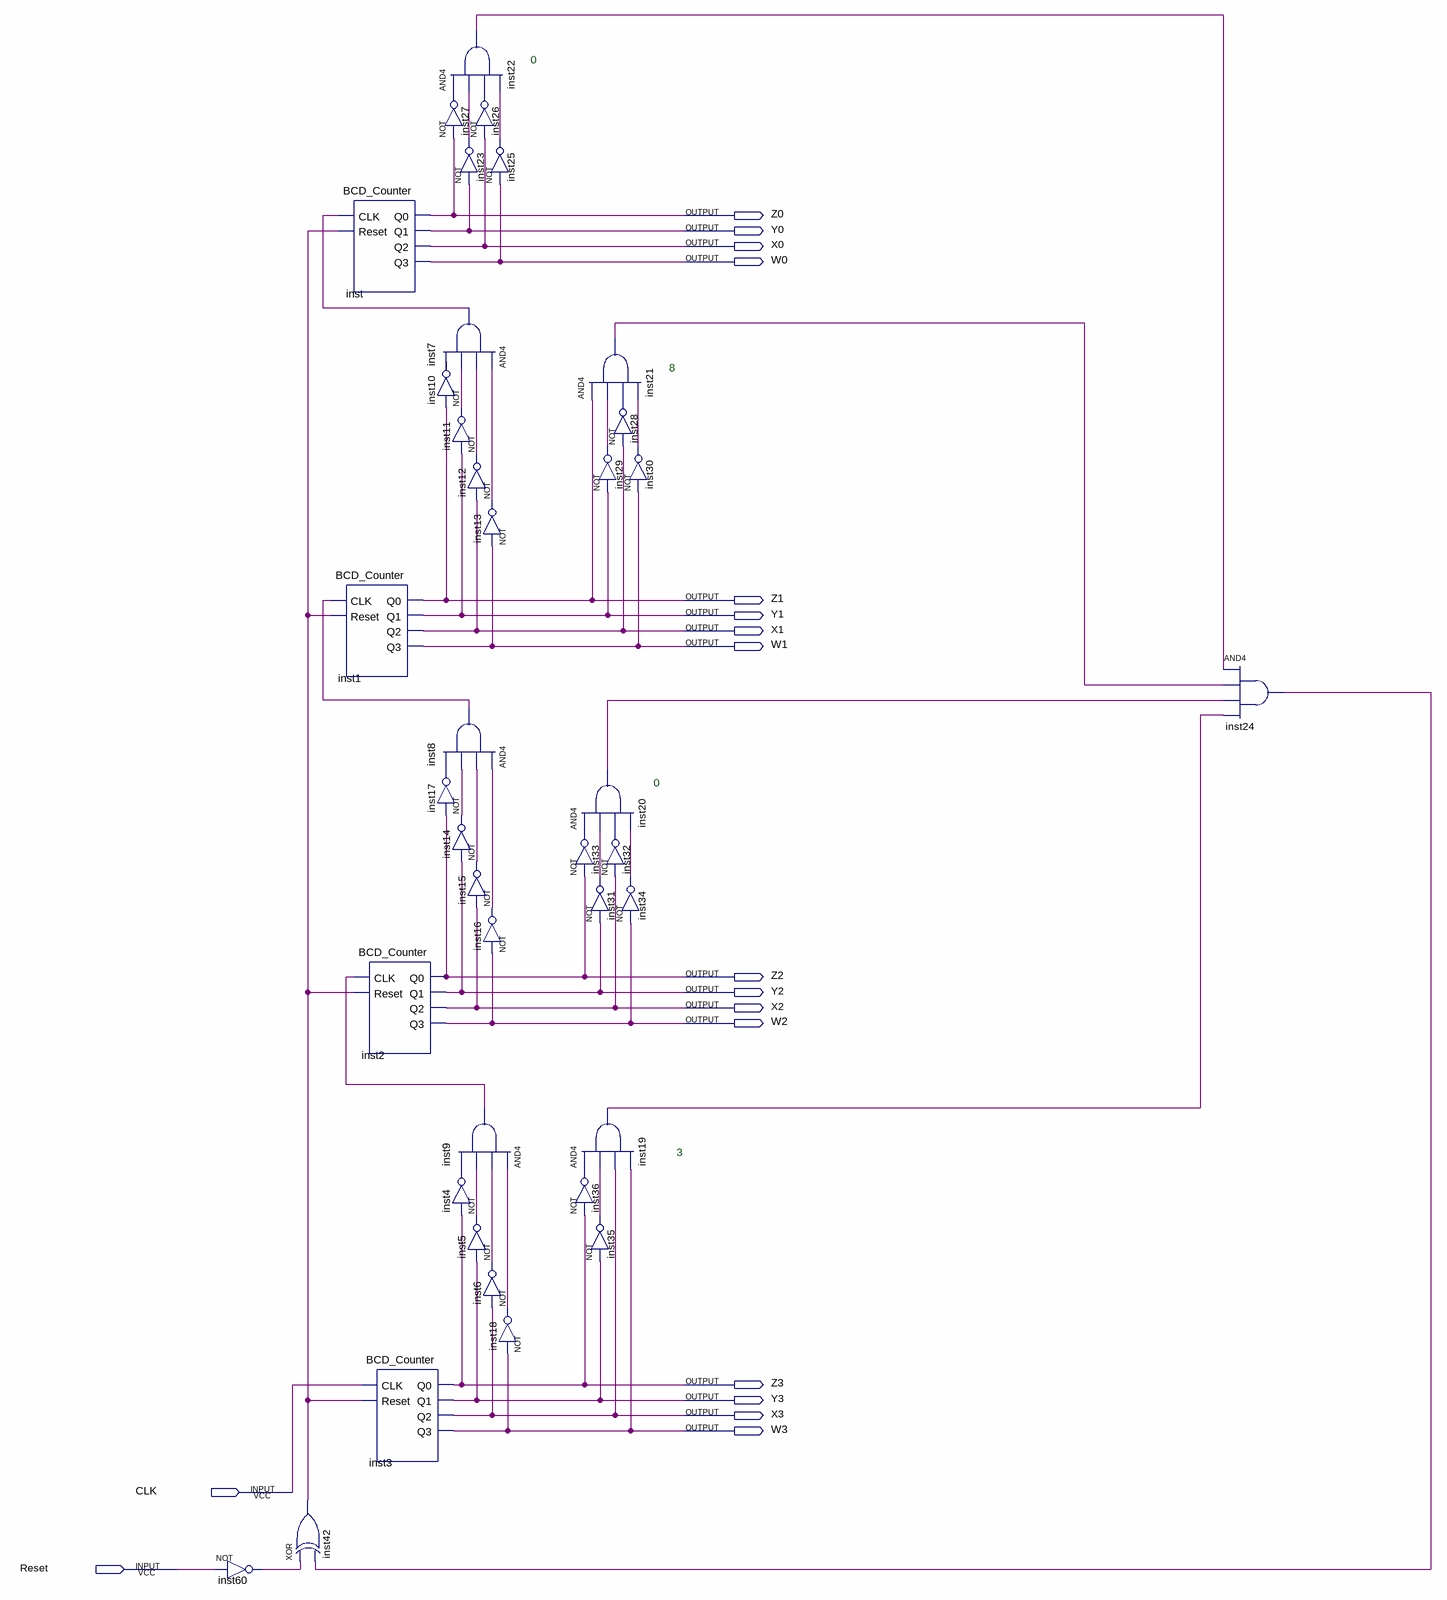
[diagram p0: schematic sheet]
// Quartus schematic Clock_Cycle_Counter.bdf as structural Verilog: 39 symbols, 18 pins
module Clock_Cycle_Counter (
  input  CLK,
  input  Reset,
  output Z0,
  output Y0,
  output X0,
  output W0,
  output Z1,
  output Y1,
  output X1,
  output W1,
  output Z2,
  output Y2,
  output X2,
  output W2,
  output Z3,
  output Y3,
  output X3,
  output W3
);

  wire inst4_out, inst5_out, inst6_out, inst7_out, inst8_out, inst9_out, inst10_out, inst11_out, inst12_out,
       inst13_out, inst14_out, inst15_out, inst16_out, inst17_out, inst18_out, inst19_out, inst20_out,
       inst21_out, inst22_out, inst23_out, inst24_out, inst25_out, inst26_out, inst27_out, inst28_out,
       inst29_out, inst30_out, inst31_out, inst32_out, inst33_out, inst34_out, inst35_out, inst36_out,
       inst42_out, inst60_out;

  not inst60 (inst60_out, Reset);
  xor inst42 (inst42_out, inst60_out, inst24_out);
  BCD_Counter inst (.CLK(inst7_out), .Reset(inst42_out), .Q0(Z0), .Q1(Y0), .Q2(X0), .Q3(W0));
  BCD_Counter inst1 (.CLK(inst8_out), .Reset(inst42_out), .Q0(Z1), .Q1(Y1), .Q2(X1), .Q3(W1));
  BCD_Counter inst2 (.CLK(inst9_out), .Reset(inst42_out), .Q0(Z2), .Q1(Y2), .Q2(X2), .Q3(W2));
  BCD_Counter inst3 (.CLK(CLK), .Reset(inst42_out), .Q0(Z3), .Q1(Y3), .Q2(X3), .Q3(W3));
  and inst22 (inst22_out, inst27_out, inst23_out, inst26_out, inst25_out);
  not inst27 (inst27_out, Z0);
  not inst26 (inst26_out, X0);
  not inst25 (inst25_out, W0);
  not inst23 (inst23_out, Y0);
  and inst7 (inst7_out, inst13_out, inst12_out, inst11_out, inst10_out);
  not inst10 (inst10_out, Z1);
  not inst11 (inst11_out, Y1);
  not inst12 (inst12_out, X1);
  not inst13 (inst13_out, W1);
  and inst8 (inst8_out, inst16_out, inst15_out, inst14_out, inst17_out);
  not inst17 (inst17_out, Z2);
  not inst14 (inst14_out, Y2);
  not inst15 (inst15_out, X2);
  not inst16 (inst16_out, W2);
  and inst9 (inst9_out, inst18_out, inst6_out, inst5_out, inst4_out);
  not inst4 (inst4_out, Z3);
  not inst5 (inst5_out, Y3);
  not inst6 (inst6_out, X3);
  not inst18 (inst18_out, W3);
  and inst21 (inst21_out, Z1, inst29_out, inst28_out, inst30_out);
  not inst28 (inst28_out, X1);
  not inst29 (inst29_out, Y1);
  and inst20 (inst20_out, inst33_out, inst31_out, inst32_out, inst34_out);
  not inst33 (inst33_out, Z2);
  not inst32 (inst32_out, X2);
  not inst31 (inst31_out, Y2);
  and inst19 (inst19_out, inst36_out, inst35_out, X3, W3);
  not inst36 (inst36_out, Z3);
  not inst35 (inst35_out, Y3);
  not inst30 (inst30_out, W1);
  not inst34 (inst34_out, W2);
  and inst24 (inst24_out, inst22_out, inst21_out, inst20_out, inst19_out);

  // Notes on the sheet:
  //   0
  //   8
  //   0
  //   3
endmodule
